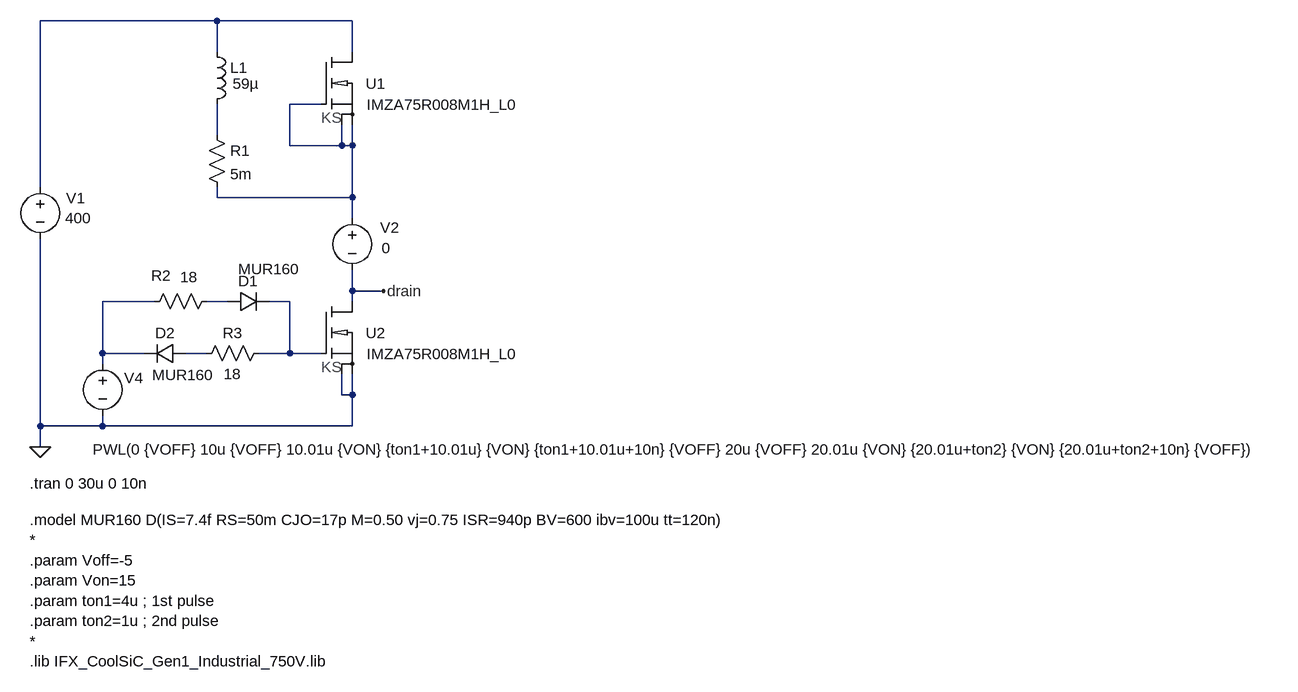
[diagram p0: schematic Double Pulse Test - Infineon.asc]
Double Pulse Test - Infineon.asc, the LTspice schematic file:
Version 4
SHEET 1 2520 820
WIRE 160 -160 -112 -160
WIRE 368 -160 160 -160
WIRE 160 -112 160 -160
WIRE 368 -112 368 -160
WIRE 320 -32 272 -32
WIRE 160 16 160 -32
WIRE 272 32 272 -32
WIRE 352 32 352 0
WIRE 352 32 272 32
WIRE 368 32 368 0
WIRE 368 32 352 32
WIRE -112 96 -112 -160
WIRE 160 112 160 96
WIRE 368 112 368 32
WIRE 368 112 160 112
WIRE 368 144 368 112
WIRE 368 256 368 224
WIRE 416 256 368 256
WIRE 64 272 -16 272
WIRE 176 272 144 272
WIRE 272 272 240 272
WIRE 368 272 368 256
WIRE -16 352 -16 272
WIRE 48 352 -16 352
WIRE 144 352 112 352
WIRE 272 352 272 272
WIRE 272 352 224 352
WIRE 320 352 272 352
WIRE -16 368 -16 352
WIRE 352 416 352 384
WIRE 368 416 368 384
WIRE 368 416 352 416
WIRE -112 464 -112 176
WIRE -16 464 -16 448
WIRE -16 464 -112 464
WIRE 368 464 368 416
WIRE 368 464 -16 464
WIRE -112 496 -112 464
FLAG 416 256 drain
FLAG -112 496 0
SYMBOL voltage -112 80 R0
WINDOW 0 40 33 Left 2
WINDOW 3 38 64 Left 2
SYMATTR InstName V1
SYMATTR Value 400
SYMBOL TO247_4L 320 -112 R0
WINDOW 3 70 81 Left 2
WINDOW 0 69 49 Left 2
SYMATTR Value IMZA75R008M1H_L0
SYMATTR InstName U1
SYMBOL TO247_4L 320 272 R0
WINDOW 3 70 81 Left 2
WINDOW 0 69 49 Left 2
SYMATTR Value IMZA75R008M1H_L0
SYMATTR InstName U2
SYMBOL ind 144 -128 R0
WINDOW 3 40 65 Left 2
SYMATTR Value 59µ
SYMATTR InstName L1
SYMBOL res 144 0 R0
SYMATTR InstName R1
SYMATTR Value 5m
SYMBOL voltage 368 128 R0
WINDOW 0 43 30 Left 2
WINDOW 3 45 62 Left 2
WINDOW 123 0 0 Left 0
WINDOW 39 0 0 Left 0
SYMATTR InstName V2
SYMATTR Value 0
SYMBOL res 160 256 R90
WINDOW 0 -8 86 VBottom 2
WINDOW 3 -37 43 VTop 2
SYMATTR InstName R2
SYMATTR Value 18
SYMBOL diode 176 288 R270
WINDOW 0 32 32 VTop 2
WINDOW 3 81 64 VBottom 2
SYMATTR InstName D1
SYMATTR Value MUR160
SYMBOL res 128 368 R270
WINDOW 0 32 56 VTop 2
WINDOW 3 0 56 VBottom 2
SYMATTR InstName R3
SYMATTR Value 18
SYMBOL diode 112 336 R90
WINDOW 0 0 32 VBottom 2
WINDOW 3 34 4 VTop 2
SYMATTR InstName D2
SYMATTR Value MUR160
SYMBOL voltage -16 352 R0
WINDOW 0 33 38 Left 2
WINDOW 3 -15 148 Left 2
WINDOW 123 0 0 Left 0
WINDOW 39 0 0 Left 0
SYMATTR InstName V4
SYMATTR Value PWL(0 {VOFF} 10u {VOFF} 10.01u {VON} {ton1+10.01u} {VON} {ton1+10.01u+10n} {VOFF} 20u {VOFF} 20.01u {VON} {20.01u+ton2} {VON} {20.01u+ton2+10n} {VOFF})
TEXT -128 552 Left 2 !.tran 0 30u 0 10n
TEXT -128 608 Left 2 !.model MUR160 D(IS=7.4f RS=50m CJO=17p M=0.50 vj=0.75 ISR=940p BV=600 ibv=100u tt=120n)\n*\n.param Voff=-5\n.param Von=15\n.param ton1=4u ; 1st pulse\n.param ton2=1u ; 2nd pulse\n*\n.lib IFX_CoolSiC_Gen1_Industrial_750V.lib

The netlist it stands for:
* Double Pulse Test - Infineon.asc
V1 N001 0 400
XU1 N001 N002 N002 N002 IMZA75R008M1H_L0  ; pins D G S1 S2
XU2 drain N006 0 0 IMZA75R008M1H_L0  ; pins D G S1 S2
L1 N001 N003 59µ
R1 N003 N002 5m
V2 N002 drain 0
R2 N005 N004 18
D1 N005 N006 MUR160
R3 N007 N006 18
D2 N007 N004 MUR160
V4 N004 0 PWL(0 {VOFF} 10u {VOFF} 10.01u {VON} {ton1+10.01u} {VON} {ton1+10.01u+10n} {VOFF} 20u {VOFF} 20.01u {VON} {20.01u+ton2} {VON} {20.01u+ton2+10n} {VOFF})
.model D D
.lib standard.dio
.tran 0 30u 0 10n
.model MUR160 D(IS=7.4f RS=50m CJO=17p M=0.50 vj=0.75 ISR=940p BV=600 ibv=100u tt=120n)
*
.param Voff=-5
.param Von=15
.param ton1=4u ; 1st pulse
.param ton2=1u ; 2nd pulse
*
.lib IFX_CoolSiC_Gen1_Industrial_750V.lib
.backanno
.end